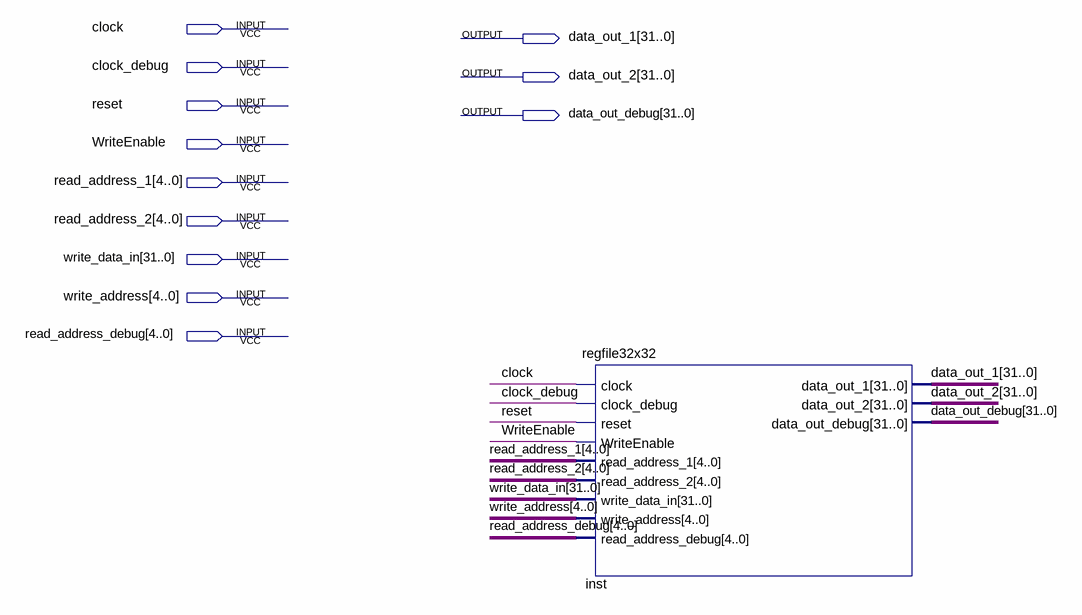
[diagram p0: schematic sheet]
// Quartus schematic registerfile.bdf as structural Verilog: 1 symbols, 12 pins
module registerfile (
  input  clock,
  input  clock_debug,
  input  reset,
  input  WriteEnable,
  input  [4:0] read_address_1,
  input  [4:0] read_address_2,
  input  [31:0] write_data_in,
  input  [4:0] write_address,
  input  [4:0] read_address_debug,
  output [31:0] data_out_1,
  output [31:0] data_out_2,
  output [31:0] data_out_debug
);

  regfile32x32 inst (
    .clock(clock), .clock_debug(clock_debug), .reset(reset), .WriteEnable(WriteEnable),
    .read_address_1(read_address_1), .read_address_2(read_address_2), .write_data_in(write_data_in),
    .write_address(write_address), .read_address_debug(read_address_debug), .data_out_1(data_out_1),
    .data_out_2(data_out_2), .data_out_debug(data_out_debug));
endmodule
